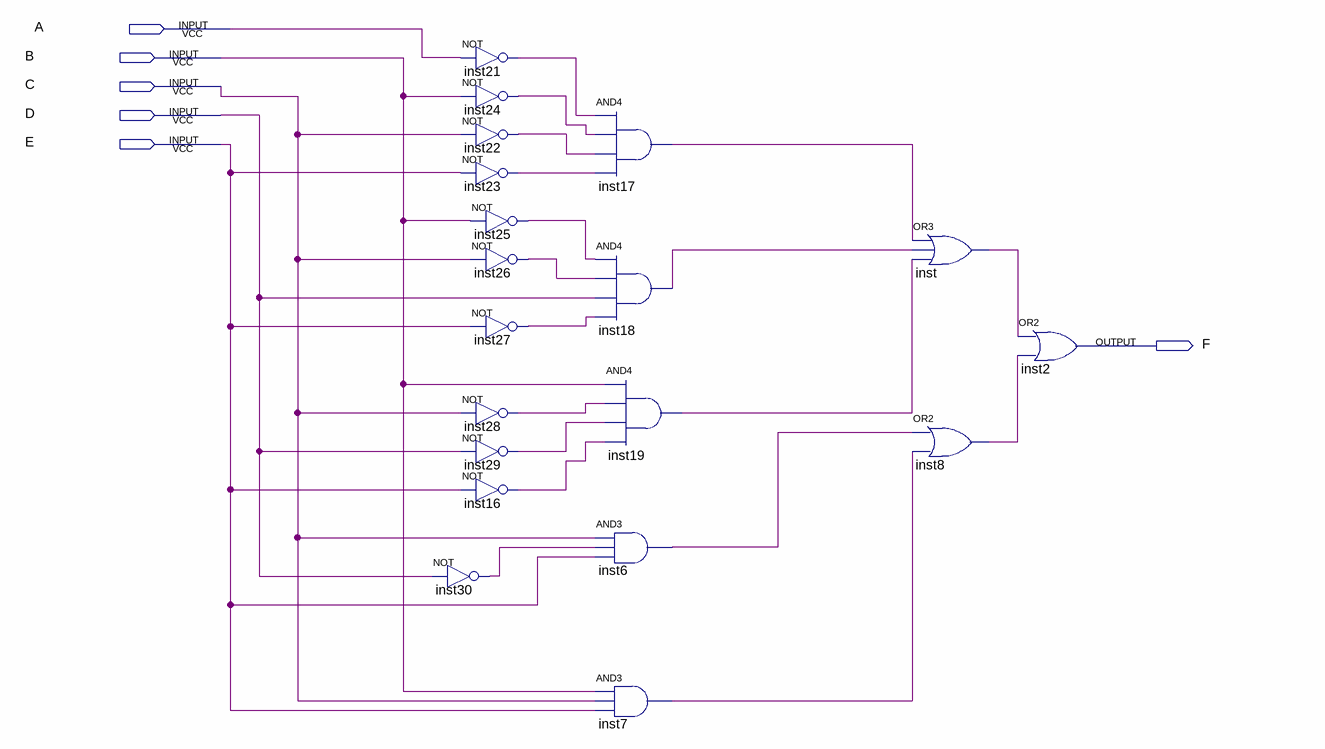
[diagram p0: schematic sheet]
// Quartus schematic esquematico.bdf as structural Verilog: 19 symbols, 6 pins
module esquematico (
  input  A,
  input  B,
  input  C,
  input  D,
  input  E,
  output F
);

  wire inst6_out, inst7_out, inst8_out, inst16_out, inst17_out, inst18_out, inst19_out, inst21_out,
       inst22_out, inst23_out, inst24_out, inst25_out, inst26_out, inst27_out, inst28_out, inst29_out,
       inst30_out, inst_out;

  not inst30 (inst30_out, D);
  not inst21 (inst21_out, A);
  not inst24 (inst24_out, B);
  not inst22 (inst22_out, C);
  not inst23 (inst23_out, E);
  not inst25 (inst25_out, B);
  not inst26 (inst26_out, C);
  not inst27 (inst27_out, E);
  not inst28 (inst28_out, C);
  not inst29 (inst29_out, D);
  not inst16 (inst16_out, E);
  and inst17 (inst17_out, inst21_out, inst24_out, inst22_out, inst23_out);
  and inst18 (inst18_out, inst25_out, inst26_out, D, inst27_out);
  and inst6 (inst6_out, C, inst30_out, E);
  and inst7 (inst7_out, B, C, E);
  and inst19 (inst19_out, B, inst28_out, inst29_out, inst16_out);
  or inst (inst_out, inst17_out, inst18_out, inst19_out);
  or inst8 (inst8_out, inst6_out, inst7_out);
  or inst2 (F, inst_out, inst8_out);
endmodule
